# Altium schematic sheet main schematic.SchDoc
size A1
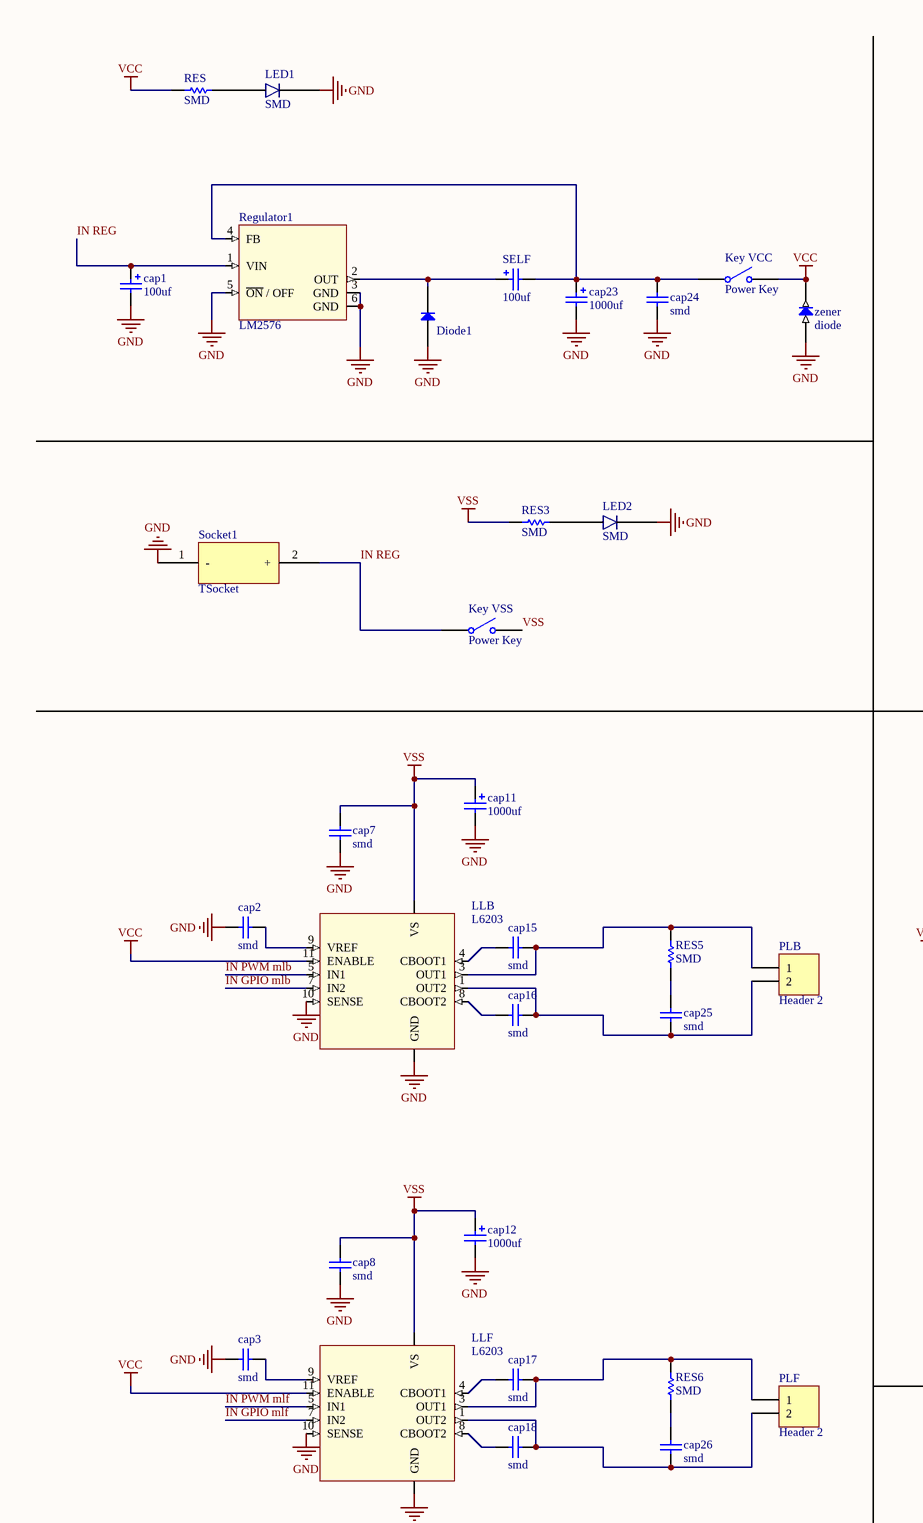
[diagram p0: main schematic.SchDoc, top left]
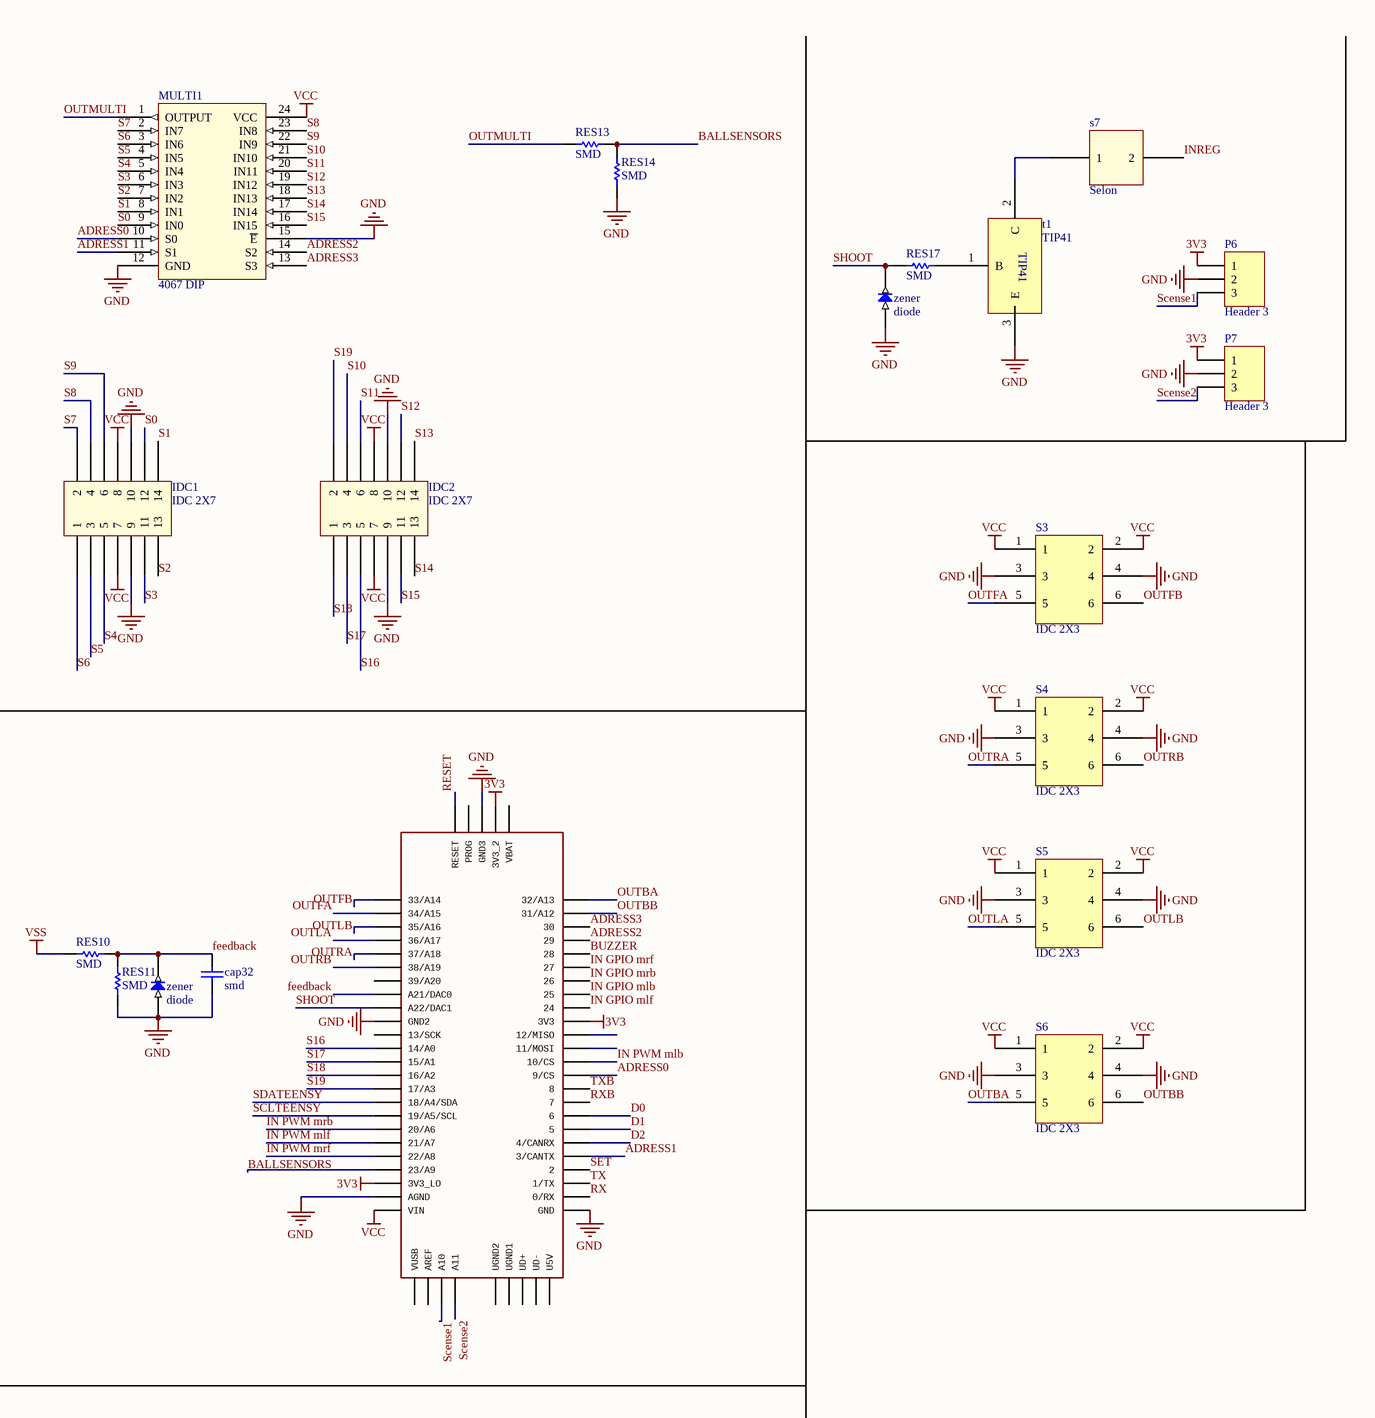
[diagram p1: main schematic.SchDoc, top right]
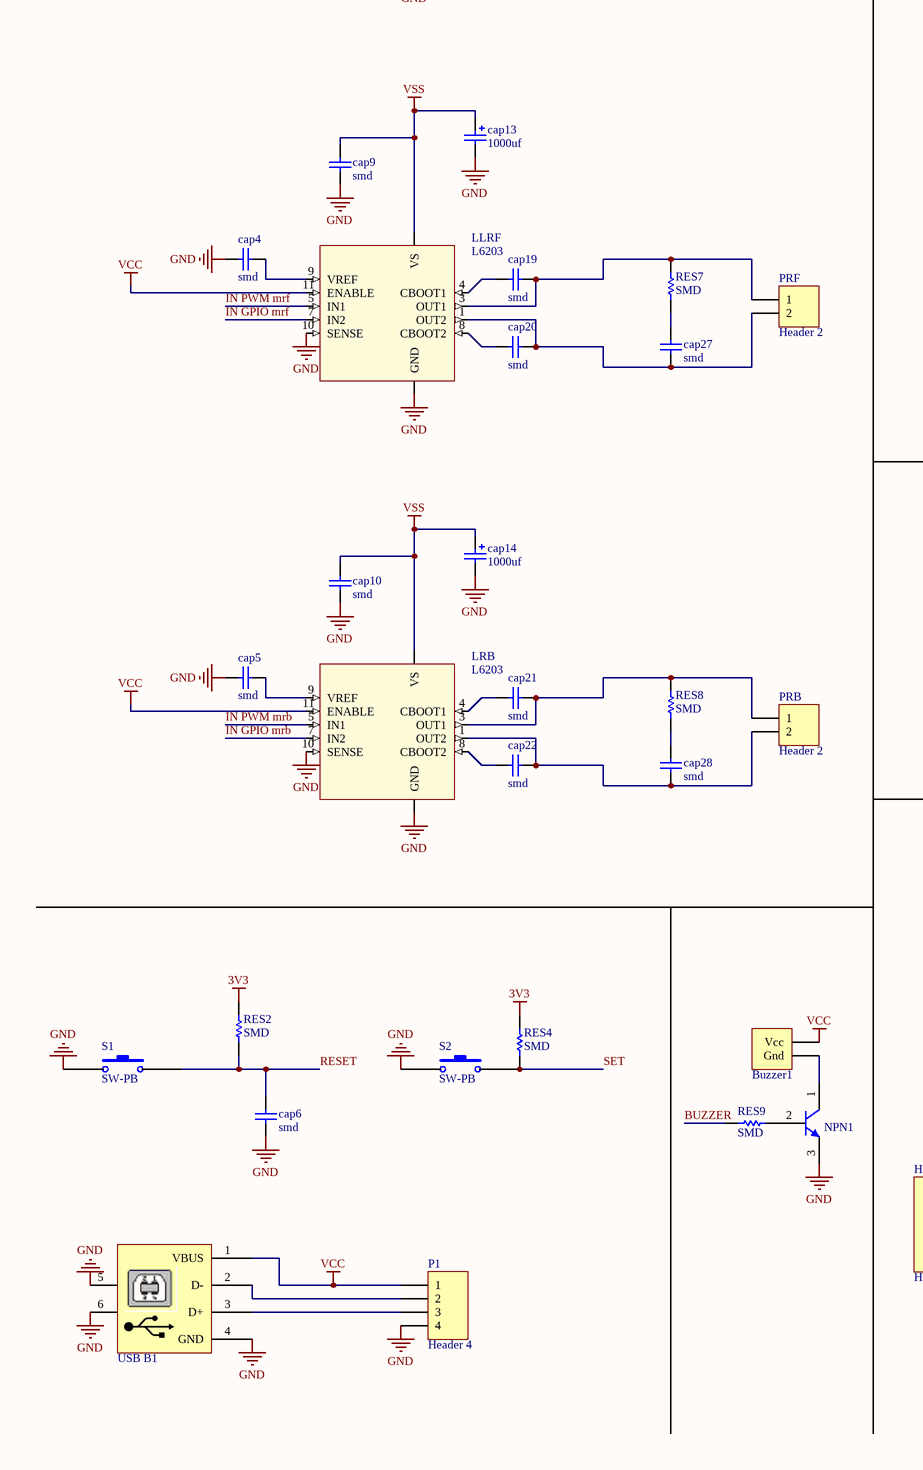
[diagram p2: main schematic.SchDoc, bottom left]
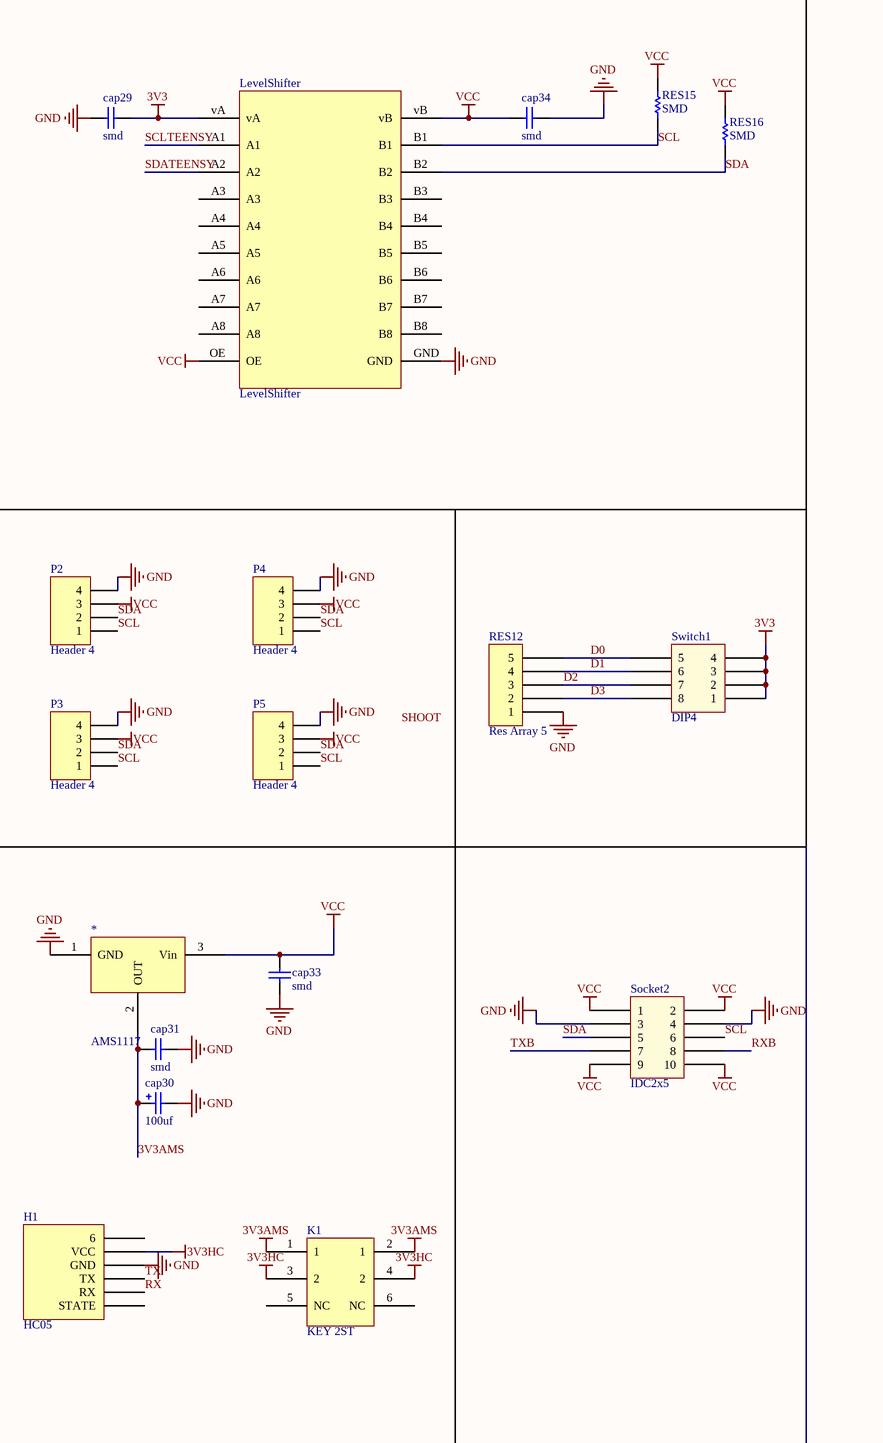
[diagram p3: main schematic.SchDoc, bottom right]

## Parts
(Parts that share a designator on the sheet are numbered #1, #2 ... from top to bottom, then left to right.)
1  TEENSY_3.5/3.6  [TEENSY_3.5/3.6]  (value not drawn)
*  AMS1117  [SOT223]
Buzzer1  Buzzer  [Buzzer]  (value not drawn)
cap1  100uf  [Cap 100uF]
cap2  smd  [Cap SMD]
cap3  smd  [Cap SMD]
cap4  smd  [Cap SMD]
cap5  smd  [Cap SMD]
cap6  smd  [Cap SMD]
cap7  smd  [Cap SMD]
cap8  smd  [Cap SMD]
cap9  smd  [Cap SMD]
cap10  smd  [Cap SMD]
cap11  1000uf  [Cap 1000uf]
cap12  1000uf  [Cap 1000uf]
cap13  1000uf  [Cap 1000uf]
cap14  1000uf  [Cap 1000uf]
cap15  smd  [Cap SMD]
cap16  smd  [Cap SMD]
cap17  smd  [Cap SMD]
cap18  smd  [Cap SMD]
cap19  smd  [Cap SMD]
cap20  smd  [Cap SMD]
cap21  smd  [Cap SMD]
cap22  smd  [Cap SMD]
cap23  1000uf  [Cap 1000uf]
cap24  smd  [Cap SMD]
cap25  smd  [Cap SMD]
cap26  smd  [Cap SMD]
cap27  smd  [Cap SMD]
cap28  smd  [Cap SMD]
cap29  smd  [Cap SMD]
cap30  100uf  [Cap 100uF]
cap31  smd  [Cap SMD]
cap32  smd  [Cap SMD]
cap33  smd  [Cap SMD]
cap34  smd  [Cap SMD]
Diode1  Diode  [Diode]  (value not drawn)
H1  HC05  [HC05]
IDC1  IDC 2X7  [IDC 2X7]
IDC2  IDC 2X7  [IDC 2X7]
K1  KEY 2ST  [KEY 2ST]
Key_VCC  Power Key  [Power Key]
Key_VSS  Power Key  [Power Key]
LED1  SMD  [LED SMD]
LED2  SMD  [LED SMD]
LevelShifter  LevelShifter  [CJMCU]
LLB  L6203  [MultiWatt11]
LLF  L6203  [MultiWatt11]
LLRF  L6203  [MultiWatt11]
LRB  L6203  [MultiWatt11]
MULTI1  4067 DIP  [4067 DIP]
NPN1  N2222A  [NPN]  (value not drawn)
P1  Header 4  [HDR1X4]
P2  Header 4  [HDR1X4]
P3  Header 4  [HDR1X4]
P4  Header 4  [HDR1X4]
P5  Header 4  [HDR1X4]
P6  Header 3  [HDR1X3]
P7  Header 3  [HDR1X3]
PLB  Header 2  [HDR1X2]
PLF  Header 2  [HDR1X2]
PRB  Header 2  [HDR1X2]
PRF  Header 2  [HDR1X2]
Regulator1  LM2576  [D2PAK]
RES  SMD  [Resistor SMD 1206]
RES2  SMD  [Resistor SMD 1206]
RES3  SMD  [Resistor SMD 1206]
RES4  SMD  [Resistor SMD 1206]
RES5  SMD  [Resistor SMD 1206]
RES6  SMD  [Resistor SMD 1206]
RES7  SMD  [Resistor SMD 1206]
RES8  SMD  [Resistor SMD 1206]
RES9  SMD  [Resistor SMD 1206]
RES10  SMD  [Resistor SMD 1206]
RES11  SMD  [Resistor SMD 1206]
RES12  Res Array 5  [Res Array 5]
RES13  SMD  [Resistor SMD 1206]
RES14  SMD  [Resistor SMD 1206]
RES15  SMD  [Resistor SMD 1206]
RES16  SMD  [Resistor SMD 1206]
RES17  SMD  [Resistor SMD 1206]
S1  SW-PB  [SW_2pin]
S2  SW-PB  [SW_2pin]
S3  IDC 2X3  [IDC 2X3]
S4  IDC 2X3  [IDC 2X3]
S5  IDC 2X3  [IDC 2X3]
S6  IDC 2X3  [IDC 2X3]
s7  Selon  [Selon Con]
SELF  100uf  [Cap 100uF]
Socket1  TSocket  [TSocket]
Socket2  IDC2x5  [IDC 2x5]
Switch1  DIP4  [DIP SW4]
t1  TIP41  [TIP41]
USB_B1  USB_B  [USB_B.1]  (value not drawn)
zener#1  diode  [LED SMD]
zener#2  diode  [LED SMD]
zener#3  diode  [LED SMD]

## Nets
3V3: 1.3V3 1.3V3_2 1.3V3_LO cap29.2 LevelShifter.vA P6.1 P7.1 RES2.2 RES4.2 Switch1.1 Switch1.2 Switch1.3 Switch1.4
3V3AMS: *.2(OUT) cap30.1 cap31.1 K1.1 K1.2(1)
3V3HC: H1.5(VCC) K1.3(2) K1.4(2)
GND: 1.AGND 1.GND 1.GND2 1.GND3 *.1(GND) cap1.2 cap2.1 cap3.1 cap4.1 cap5.1 cap6.1 cap7.1 cap8.1 cap9.1 cap10.1 cap11.2 cap12.2 cap13.2 cap14.2 cap23.2 cap24.1 cap29.1 cap30.2 cap31.2 cap32.1 cap33.1 cap34.2 Diode1.1(A) H1.4(GND) IDC1.9 IDC1.10 IDC2.9 IDC2.10 LED1.2 LED2.2 LevelShifter.GND LLB.6(GND) LLB.10(SENSE) LLF.6(GND) LLF.10(SENSE) LLRF.6(GND) LLRF.10(SENSE) LRB.6(GND) LRB.10(SENSE) MULTI1.12(GND) MULTI1.15(~{E}) NPN1.3(E) P1.4 P2.4 P3.4 P4.4 P5.4 P6.2 P7.2 Regulator1.3(GND) Regulator1.5(~{ON}_/_OFF) Regulator1.6(GND) RES11.1 RES12.1 RES14.1 S1.2 S2.2 S3.3 S3.4 S4.3 S4.4 S5.3 S5.4 S6.3 S6.4 Socket1.1(-) Socket2.3 Socket2.4 t1.3(E) USB_B1.4(GND) USB_B1.5 USB_B1.6 zener#1.1(in) zener#2.1(in) zener#3.1(in)
VCC: 1.VIN *.3(Vin) Buzzer1.1(Vcc) cap33.2 cap34.1 IDC1.7 IDC1.8 IDC2.7 IDC2.8 Key_VCC.2(NO) LevelShifter.OE LevelShifter.vB LLB.11(ENABLE) LLF.11(ENABLE) LLRF.11(ENABLE) LRB.11(ENABLE) MULTI1.24(VCC) P1.1 P2.3 P3.3 P4.3 P5.3 RES.1 RES15.2 RES16.2 S3.1 S3.2 S4.1 S4.2 S5.1 S5.2 S6.1 S6.2 Socket2.1 Socket2.2 Socket2.9 Socket2.10 USB_B1.1(VBUS) zener#2.2(out)
VSS: cap7.2 cap8.2 cap9.2 cap10.2 cap11.1 cap12.1 cap13.1 cap14.1 Key_VSS.2(NO) LLB.2(VS) LLF.2(VS) LLRF.2(VS) LRB.2(VS) RES3.1 RES10.1
ADRESS0: 1.9/CS MULTI1.10(S0)
ADRESS1: 1.3/CANTX MULTI1.11(S1)
ADRESS2: 1.29 MULTI1.14(S2)
ADRESS3: 1.30 MULTI1.13(S3)
BALLSENSORS: 1.23/A9 RES13.2 RES14.2
BUZZER: 1.28 RES9.1
D0: 1.6 RES12.5 Switch1.5
D1: 1.5 RES12.4 Switch1.6
D2: 1.4/CANRX RES12.3 Switch1.7
D3: RES12.2 Switch1.8
feedback: 1.21/DAC0(A21/DAC0) cap32.2 RES10.2 RES11.2 zener#3.2(out)
IN GPIO mlb: 1.25 LLB.7(IN2)
IN GPIO mlf: 1.24 LLF.7(IN2)
IN GPIO mrb: 1.26 LRB.7(IN2)
IN GPIO mrf: 1.27 LLRF.7(IN2)
IN PWM mlb: 1.10/CS LLB.5(IN1)
IN PWM mlf: 1.21/A7 LLF.5(IN1)
IN PWM mrb: 1.20/A6 LRB.5(IN1)
IN PWM mrf: 1.22/A8 LLRF.5(IN1)
IN REG: cap1.1 Key_VSS.1(COMMON) Regulator1.1(VIN) Socket1.2(+)
INREG: s7.2
OUTBA: 1.32/A13 S6.5
OUTBB: 1.31/A12 S6.6
OUTFA: 1.34/A15 S3.5
OUTFB: 1.33/A14 S3.6
OUTLA: 1.36/A17 S5.5
OUTLB: 1.35/A16 S5.6
OUTMULTI: MULTI1.1(OUTPUT) RES13.1
OUTRA: 1.37/A18 S4.5
OUTRB: 1.38/A19 S4.6
RESET: 1.RESET cap6.2 RES2.1 S1.1
RX: 1.0/RX H1.2(RX)
RXB: 1.7 Socket2.8
S0: IDC1.12 MULTI1.9(IN0)
S1: IDC1.14 MULTI1.8(IN1)
S2: IDC1.13 MULTI1.7(IN2)
S3: IDC1.11 MULTI1.6(IN3)
S4: IDC1.5 MULTI1.5(IN4)
S5: IDC1.3 MULTI1.4(IN5)
S6: IDC1.1 MULTI1.3(IN6)
S7: IDC1.2 MULTI1.2(IN7)
S8: IDC1.4 MULTI1.23(IN8)
S9: IDC1.6 MULTI1.22(IN9)
S10: IDC2.4 MULTI1.21(IN10)
S11: IDC2.6 MULTI1.20(IN11)
S12: IDC2.12 MULTI1.19(IN12)
S13: IDC2.14 MULTI1.18(IN13)
S14: IDC2.13 MULTI1.17(IN14)
S15: IDC2.11 MULTI1.16(IN15)
S16: 1.14/A0 IDC2.5
S17: 1.15/A1 IDC2.3
S18: 1.16/A2 IDC2.1
S19: 1.17/A3 IDC2.2
Scense1: 1.A10 P6.3
Scense2: 1.A11 P7.3
SCL: LevelShifter.B1 P2.1 P3.1 P4.1 P5.1 RES15.1 Socket2.6
SCLTEENSY: 1.19/A5/SCL LevelShifter.A1
SDA: LevelShifter.B2 P2.2 P3.2 P4.2 P5.2 RES16.1 Socket2.5
SDATEENSY: 1.18/A4/SDA LevelShifter.A2
SET: 1.2 RES4.1 S2.1
SHOOT: 1.A22/DAC1 RES17.1 zener#1.2(out)
TX: 1.1/TX H1.3(TX)
TXB: 1.8 Socket2.7
NetBuzzer1_2: Buzzer1.2(Gnd) NPN1.1(C)
Netcap2_2: cap2.2 LLB.9(VREF)
Netcap3_2: cap3.2 LLF.9(VREF)
Netcap4_2: cap4.2 LLRF.9(VREF)
Netcap5_2: cap5.2 LRB.9(VREF)
Netcap15_1: cap15.1 LLB.4(CBOOT1)
Netcap15_2: cap15.2 LLB.3(OUT1) PLB.1 RES5.2
Netcap16_1: cap16.1 LLB.8(CBOOT2)
Netcap16_2: cap16.2 cap25.1 LLB.1(OUT2) PLB.2
Netcap17_1: cap17.1 LLF.4(CBOOT1)
Netcap17_2: cap17.2 LLF.3(OUT1) PLF.1 RES6.2
Netcap18_1: cap18.1 LLF.8(CBOOT2)
Netcap18_2: cap18.2 cap26.1 LLF.1(OUT2) PLF.2
Netcap19_1: cap19.1 LLRF.4(CBOOT1)
Netcap19_2: cap19.2 LLRF.3(OUT1) PRF.1 RES7.2
Netcap20_1: cap20.1 LLRF.8(CBOOT2)
Netcap20_2: cap20.2 cap27.1 LLRF.1(OUT2) PRF.2
Netcap21_1: cap21.1 LRB.4(CBOOT1)
Netcap21_2: cap21.2 LRB.3(OUT1) PRB.1 RES8.2
Netcap22_1: cap22.1 LRB.8(CBOOT2)
Netcap22_2: cap22.2 cap28.1 LRB.1(OUT2) PRB.2
Netcap23_1: cap23.1 cap24.2 Key_VCC.1(COMMON) Regulator1.4(FB) SELF.2
Netcap25_2: cap25.2 RES5.1
Netcap26_2: cap26.2 RES6.1
Netcap27_2: cap27.2 RES7.1
Netcap28_2: cap28.2 RES8.1
NetDiode1_2: Diode1.2(K) Regulator1.2(OUT) SELF.1
NetLED1_1: LED1.1 RES.2
NetLED2_1: LED2.1 RES3.2
NetNPN1_2: NPN1.2(B) RES9.2
NetP1_2: P1.2 USB_B1.2(D-)
NetP1_3: P1.3 USB_B1.3(D+)
NetRES17_2: RES17.2 t1.1(B)
Nets7_1: s7.1 t1.2(C)

Not connected (* = marked no-connect by the designer): 1 11/MOSI 12/MISO 13/SCK 39/A20 AREF PROG U5V UD+ UD- UGND1 UGND2 VBAT VUSB; H1 1(STATE) 6; K1 5(NC) 6(NC); LevelShifter A3 A4 A5 A6 A7 A8 B3 B4 B5 B6 B7 B8

## Notes on the sheet
- Labels drawn without touching a wire or pin: SHOOT

## Library data of the parts
1 = TEENSY_3.5/3.6: GateName_1: G$1; SymbolName_1: TEENSY_3.5/3.6; LibraryName: Teensy356; DeviceSetName: TEENSY_3.5/3.6; Package: TEENSY_3.5/3.6
cap1 cap30 SELF = Cap 100uF
cap2-cap10 cap15-cap22 cap24-cap29 cap31-cap34 = Cap SMD
cap11-cap14 cap23 = Cap 1000uF
LED1 LED2 = LED SMD
NPN1 = NPN
P1-P5 = Header 4: Header, 4-Pin; LatestRevisionDate: 17-Jul-2002; LatestRevisionNote: Re-released for DXP Platform.; Publisher: Altium Limited
P6 P7 = Header 3: Header, 3-Pin; LatestRevisionDate: 17-Jul-2002; LatestRevisionNote: Re-released for DXP Platform.; Publisher: Altium Limited
PLB PLF PRB PRF = Header 2: Header, 2-Pin; LatestRevisionDate: 17-Jul-2002; LatestRevisionNote: Re-released for DXP Platform.; Publisher: Altium Limited
RES RES2-RES11 RES13-RES17 = Res SMD
S1 S2 = SW-PB: Switch; Published: 24-Mar-1999; LatestRevisionDate: 17-Jul-2002; LatestRevisionNote: Re-released for DXP Platform.; PackageReference: SPST-2; Publisher: Altium Limited; PackageDescription: Switch; 2 Leads
Socket2 = IDC 2x5
Switch1 = DIP SW 4
USB_B1 = USB_B: USB B; LatestRevisionDate: 17-Jul-2002; LatestRevisionNote: Re-released for DXP Platform.; Publisher: Altium Limited
zener#1-zener#3 = SMDZenerDiode